# EAGLE design battery-monitor (EAGLE 9.6.2)
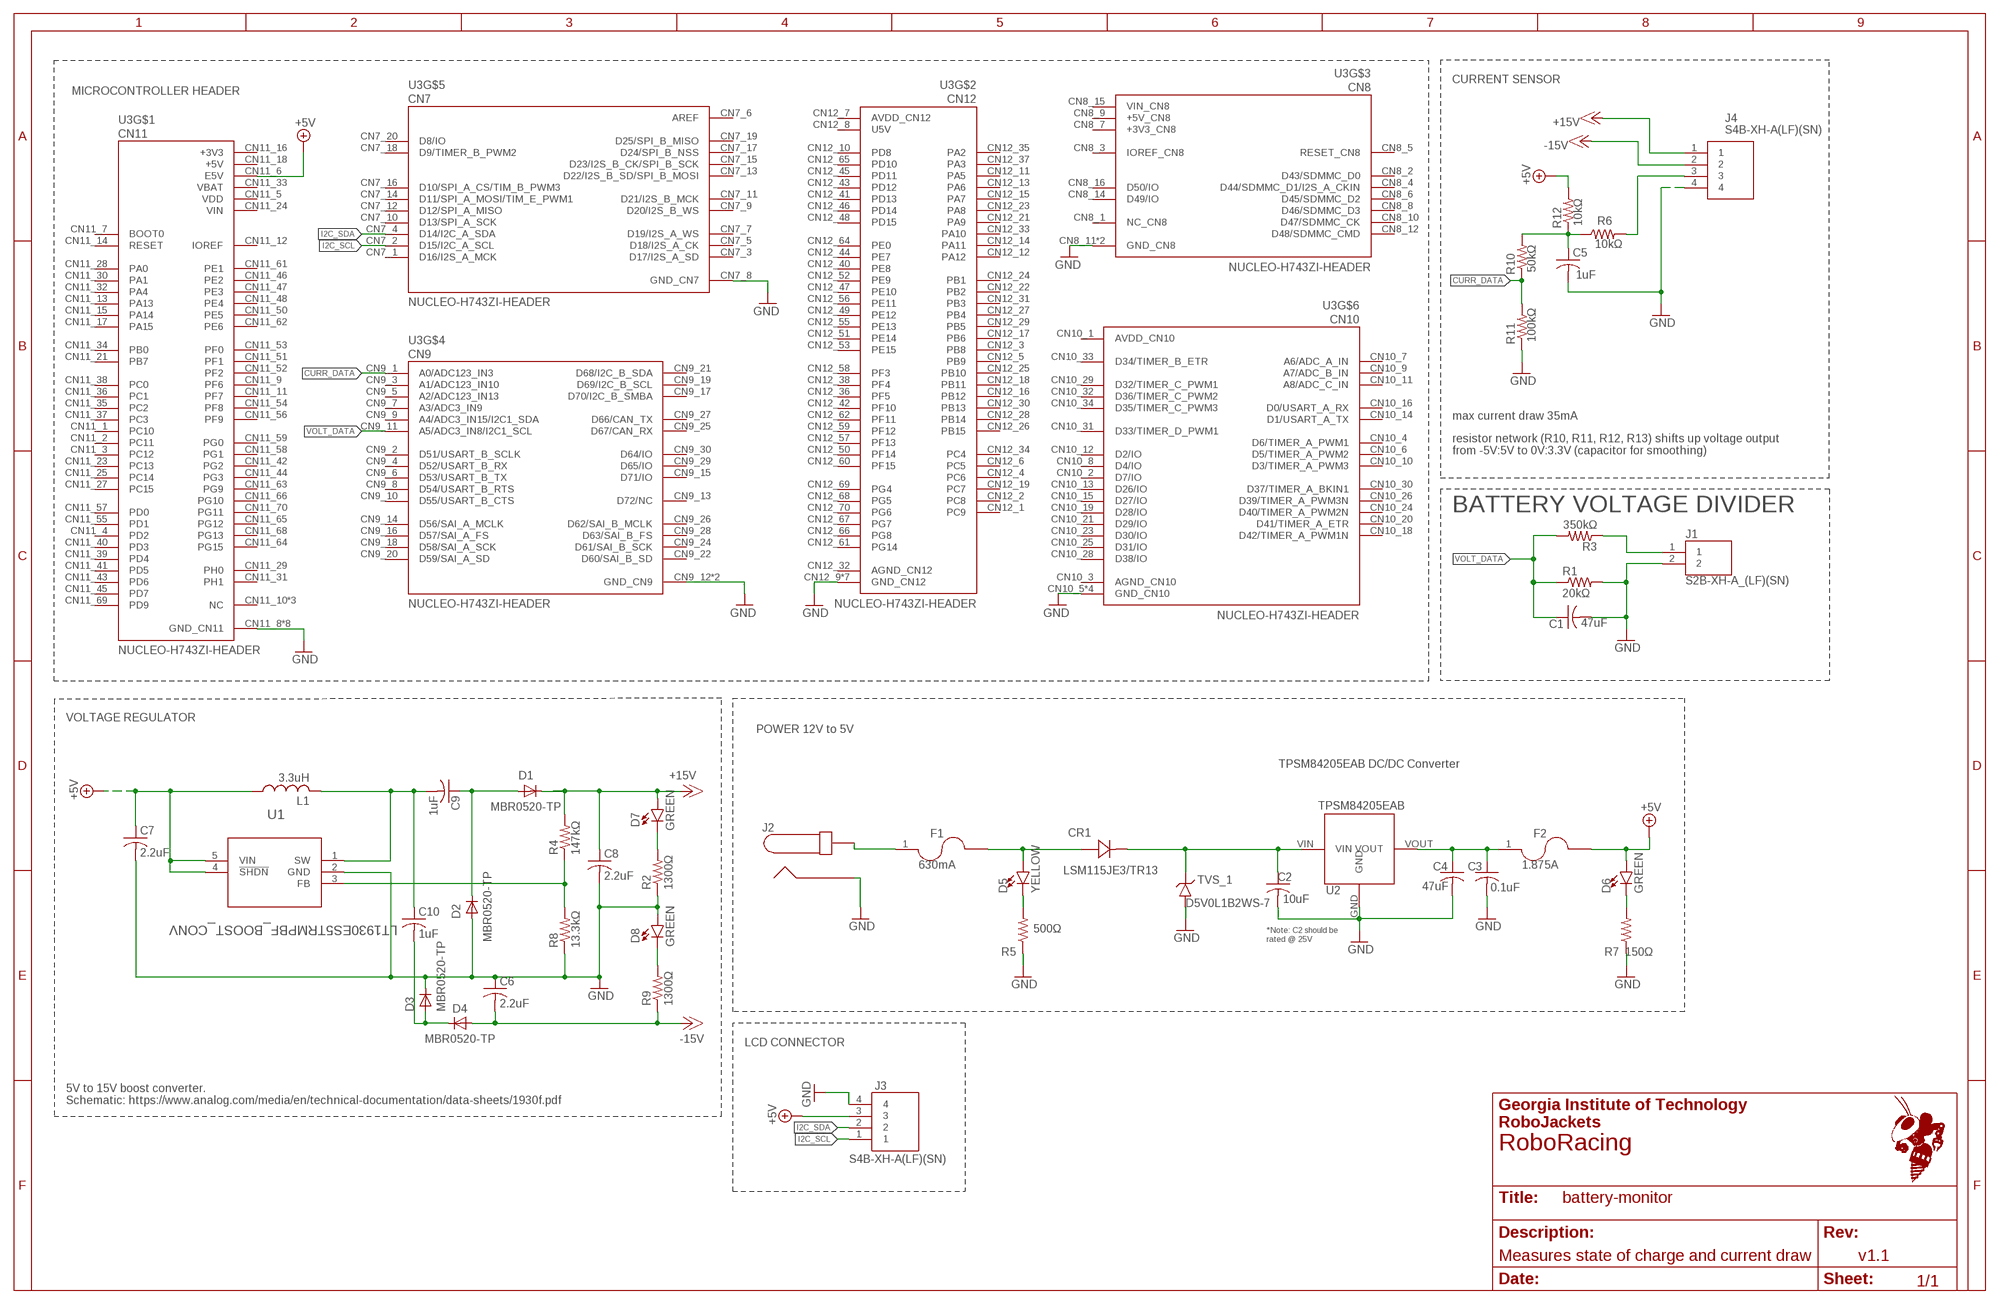
[diagram p0: schematic, sheet 1]
FRAME1 (FRAME_11_17): REVISION: v1.1; SCH_DESC: Measures state of charge and current draw; TEAM: RoboRacing

## Parts
C1  47uF  C-USC0603  [C0603]
C2  10uF  C-USC0603  [C0603]
C3  0.1uF  C-USC0603  [C0603]
C4  47uF  C-USC0603  [C0603]
C5  1uF  C-USC0603  [C0603]
C6  2.2uF  C-USC1206  [C1206]
C7  2.2uF  C-USC0805  [C0805]
C8  2.2uF  C-USC1206  [C1206]
C9  1uF  C-USC0603  [C0603]
C10  1uF  C-USC0603  [C0603]
CR1  LSM115JE3/TR13  [DO-214BA_MCH]
D1  MBR0520-TP  DIODE-SOD123  [SOD123]
D2  MBR0520-TP  DIODE-SOD123  [SOD123]
D3  MBR0520-TP  DIODE-SOD123  [SOD123]
D4  MBR0520-TP  DIODE-SOD123  [SOD123]
D5  YELLOW  LED-YELLOW0603  [LED-0603]
D6  GREEN  LED-GREEN1206  [LED-1206]
D7  GREEN  LED-GREEN0603  [LED-0603]
D8  GREEN  LED-GREEN0603  [LED-0603]
F1  630mA  SMD_FUSE0603  [F0603]
F2  1.875A  SMD_FUSE0603  [F0603]
J1  S2B-XH-A_(LF)(SN)  [SHDR2W80P0X250_1X2_740X1150X61]
J2  PJ-037A  [PJ-037A]
J3  S4B-XH-A(LF)(SN)  [SHDR4W64P0X250_1X4_1240X1155X7]
J4  S4B-XH-A(LF)(SN)  [SHDR4W64P0X250_1X4_1240X1155X7]
L1  3.3uH  L-USL3225M  [L3225M]
R1  20kΩ  R-US_R0603  [R0603]
R2  1300Ω  R-US_R0603  [R0603]
R3  350kΩ  R-US_R0603  [R0603]
R4  147kΩ  R-US_R0603  [R0603]
R5  500Ω  R-US_R0603  [R0603]
R6  10kΩ  R-US_R0603  [R0603]
R7  150Ω  R-US_R0603  [R0603]
R8  13.3kΩ  R-US_R0603  [R0603]
R9  1300Ω  R-US_R0603  [R0603]
R10  50kΩ  R-US_R0603  [R0603]
R11  100kΩ  R-US_R0603  [R0603]
R12  10kΩ  R-US_R0603  [R0603]
TVS_1  D5V0L1B2WS-7  [SOD-323]
U1  LT1930ES5TRMPBF_BOOST_CONV  [SOT-5_S]
U2  TPSM84205EAB  [TPSM84205EAB]
U3  NUCLEO-H743ZI-HEADER  [MODULE_NUCLEO-HEADER]

## Nets
5V_MAIN: C3.1 C4.1 F2.1 U2.VOUT
+5V [vcc]: C7.1 D6.A F2.2 J3.3 L1.1 R12.2 U1.4(!SHDN) U1.5(VIN) U3.CN11_6(E5V)
+15V [vcc]: C8.1 D1.C D7.A J4.1 R4.2
-15V [vcc]: C6.2 D4.A J4.2 R9.1
CURR_DATA [data]: R10.1 R11.2 U3.CN9_1(A0/ADC123_IN3)
CURR_RAW [data]: J4.3 R6.2
GND: C1.2 C2.2 C3.2 C4.2 C5.2 C6.1 C7.2 C8.2 D2.A D3.C D8.A J1.2 J2.P$1 J3.4 J4.4 R1.2 R2.1 R5.1 R7.1 R8.1 R11.1 TVS_1.A U1.2(GND) U2.GND U3.CN7_8(GND_CN7) U3.CN8_11(GND_CN8) U3.CN8_13(GND_CN8) U3.CN9_12(GND_CN9) U3.CN9_23(GND_CN9) U3.CN10_5(GND_CN10) U3.CN10_17(GND_CN10) U3.CN10_22(GND_CN10) U3.CN10_27(GND_CN10) U3.CN11_8(GND_CN11) U3.CN11_19(GND_CN11) U3.CN11_20(GND_CN11) U3.CN11_22(GND_CN11) U3.CN11_49(GND_CN11) U3.CN11_60(GND_CN11) U3.CN11_71(GND_CN11) U3.CN11_72(GND_CN11) U3.CN12_9(GND_CN12) U3.CN12_20(GND_CN12) U3.CN12_39(GND_CN12) U3.CN12_54(GND_CN12) U3.CN12_63(GND_CN12) U3.CN12_71(GND_CN12) U3.CN12_72(GND_CN12)
I2C_SCL: J3.1 U3.CN7_2(D15/I2C_A_SCL)
I2C_SDA: J3.2 U3.CN7_4(D14/I2C_A_SDA)
N$1: J1.1 R3.1
N$2: CR1.2 D5.A F1.2
N$3: C2.1 CR1.1 TVS_1.C U2.VIN
N$4: F1.1 J2.P$2
N$5: R4.1 R8.2 U1.3(FB)
N$6: C9.2 C10.1 L1.2 U1.1(SW)
N$7: D5.C R5.2
N$8: C10.2 D3.A D4.C
N$10: D6.C R7.2
N$11: C5.1 R6.1 R10.2 R12.1
N$14: D7.C R2.2
N$16: C9.1 D1.A D2.C
N$17: D8.C R9.2
VOLT_DATA: C1.1 R1.1 R3.2 U3.CN9_11(A5/ADC3_IN8/I2C1_SCL)
Unconnected: U3.CN7_1(D16/I2S_A_MCK) U3.CN7_3(D17/I2S_A_SD) U3.CN7_5(D18/I2S_A_CK) U3.CN7_7(D19/I2S_A_WS) U3.CN7_9(D20/I2S_B_WS) U3.CN7_10(D13/SPI_A_SCK) U3.CN7_11(D21/I2S_B_MCK) U3.CN7_12(D12/SPI_A_MISO) U3.CN7_13(D22/I2S_B_SD/SPI_B_MOSI) U3.CN7_14(D11/SPI_A_MOSI/TIM_E_PWM1) U3.CN7_15(D23/I2S_B_CK/SPI_B_SCK) U3.CN7_16(D10/SPI_A_CS/TIM_B_PWM3) U3.CN7_17(D24/SPI_B_NSS) U3.CN7_18(D9/TIMER_B_PWM2) U3.CN7_19(D25/SPI_B_MISO) U3.CN7_20(D8/IO) U3.CN8_1(NC_CN8) U3.CN8_2(D43/SDMMC_D0) U3.CN8_3(IOREF_CN8) U3.CN8_4(D44/SDMMC_D1/I2S_A_CKIN) U3.CN8_5(RESET_CN8) U3.CN8_6(D45/SDMMC_D2) U3.CN8_8(D46/SDMMC_D3) U3.CN8_10(D47/SDMMC_CK) U3.CN8_12(D48/SDMMC_CMD) U3.CN8_14(D49/IO) U3.CN8_16(D50/IO) U3.CN9_2(D51/USART_B_SCLK) U3.CN9_3(A1/ADC123_IN10) U3.CN9_4(D52/USART_B_RX) U3.CN9_5(A2/ADC123_IN13) U3.CN9_6(D53/USART_B_TX) U3.CN9_7(A3/ADC3_IN9) U3.CN9_8(D54/USART_B_RTS) U3.CN9_9(A4/ADC3_IN15/I2C1_SDA) U3.CN9_10(D55/USART_B_CTS) U3.CN9_13(D72/NC) U3.CN9_14(D56/SAI_A_MCLK) U3.CN9_15(D71/IO) U3.CN9_16(D57/SAI_A_FS) U3.CN9_17(D70/I2C_B_SMBA) U3.CN9_18(D58/SAI_A_SCK) U3.CN9_19(D69/I2C_B_SCL) U3.CN9_20(D59/SAI_A_SD) U3.CN9_21(D68/I2C_B_SDA) U3.CN9_22(D60/SAI_B_SD) U3.CN9_24(D61/SAI_B_SCK) U3.CN9_25(D67/CAN_RX) U3.CN9_26(D62/SAI_B_MCLK) U3.CN9_27(D66/CAN_TX) U3.CN9_28(D63/SAI_B_FS) U3.CN9_29(D65/IO) U3.CN9_30(D64/IO) U3.CN10_2(D7/IO) U3.CN10_4(D6/TIMER_A_PWM1) U3.CN10_6(D5/TIMER_A_PWM2) U3.CN10_7(A6/ADC_A_IN) U3.CN10_8(D4/IO) U3.CN10_9(A7/ADC_B_IN) U3.CN10_10(D3/TIMER_A_PWM3) U3.CN10_11(A8/ADC_C_IN) U3.CN10_12(D2/IO) U3.CN10_13(D26/IO) U3.CN10_14(D1/USART_A_TX) U3.CN10_15(D27/IO) U3.CN10_16(D0/USART_A_RX) U3.CN10_18(D42/TIMER_A_PWM1N) U3.CN10_19(D28/IO) U3.CN10_20(D41/TIMER_A_ETR) U3.CN10_21(D29/IO) U3.CN10_23(D30/IO) U3.CN10_24(D40/TIMER_A_PWM2N) U3.CN10_25(D31/IO) U3.CN10_26(D39/TIMER_A_PWM3N) U3.CN10_28(D38/IO) U3.CN10_29(D32/TIMER_C_PWM1) U3.CN10_30(D37/TIMER_A_BKIN1) U3.CN10_31(D33/TIMER_D_PWM1) U3.CN10_32(D36/TIMER_C_PWM2) U3.CN10_33(D34/TIMER_B_ETR) U3.CN10_34(D35/TIMER_C_PWM3) U3.CN11_1(PC10) U3.CN11_2(PC11) U3.CN11_3(PC12) U3.CN11_4(PD2) U3.CN11_7(BOOT0) U3.CN11_9(PF6) U3.CN11_10(NC) U3.CN11_11(PF7) U3.CN11_12(IOREF) U3.CN11_13(PA13) U3.CN11_14(RESET) U3.CN11_15(PA14) U3.CN11_17(PA15) U3.CN11_21(PB7) U3.CN11_23(PC13) U3.CN11_25(PC14) U3.CN11_26(NC) U3.CN11_27(PC15) U3.CN11_28(PA0) U3.CN11_29(PH0) U3.CN11_30(PA1) U3.CN11_31(PH1) U3.CN11_32(PA4) U3.CN11_34(PB0) U3.CN11_35(PC2) U3.CN11_36(PC1) U3.CN11_37(PC3) U3.CN11_38(PC0) U3.CN11_39(PD4) U3.CN11_40(PD3) U3.CN11_41(PD5) U3.CN11_42(PG2) U3.CN11_43(PD6) U3.CN11_44(PG3) U3.CN11_45(PD7) U3.CN11_46(PE2) U3.CN11_47(PE3) U3.CN11_48(PE4) U3.CN11_50(PE5) U3.CN11_51(PF1) U3.CN11_52(PF2) U3.CN11_53(PF0) U3.CN11_54(PF8) U3.CN11_55(PD1) U3.CN11_56(PF9) U3.CN11_57(PD0) U3.CN11_58(PG1) U3.CN11_59(PG0) U3.CN11_61(PE1) U3.CN11_62(PE6) U3.CN11_63(PG9) U3.CN11_64(PG15) U3.CN11_65(PG12) U3.CN11_66(PG10) U3.CN11_67(NC) U3.CN11_68(PG13) U3.CN11_69(PD9) U3.CN11_70(PG11) U3.CN12_1(PC9) U3.CN12_2(PC8) U3.CN12_3(PB8) U3.CN12_4(PC6) U3.CN12_5(PB9) U3.CN12_6(PC5) U3.CN12_10(PD8) U3.CN12_11(PA5) U3.CN12_12(PA12) U3.CN12_13(PA6) U3.CN12_14(PA11) U3.CN12_15(PA7) U3.CN12_16(PB12) U3.CN12_17(PB6) U3.CN12_18(PB11) U3.CN12_19(PC7) U3.CN12_21(PA9) U3.CN12_22(PB2) U3.CN12_23(PA8) U3.CN12_24(PB1) U3.CN12_25(PB10) U3.CN12_26(PB15) U3.CN12_27(PB4) U3.CN12_28(PB14) U3.CN12_29(PB5) U3.CN12_30(PB13) U3.CN12_31(PB3) U3.CN12_33(PA10) U3.CN12_34(PC4) U3.CN12_35(PA2) U3.CN12_36(PF5) U3.CN12_37(PA3) U3.CN12_38(PF4) U3.CN12_40(PE8) U3.CN12_41(PD13) U3.CN12_42(PF10) U3.CN12_43(PD12) U3.CN12_44(PE7) U3.CN12_45(PD11) U3.CN12_46(PD14) U3.CN12_47(PE10) U3.CN12_48(PD15) U3.CN12_49(PE12) U3.CN12_50(PF14) U3.CN12_51(PE14) U3.CN12_52(PE9) U3.CN12_53(PE15) U3.CN12_55(PE13) U3.CN12_56(PE11) U3.CN12_57(PF13) U3.CN12_58(PF3) U3.CN12_59(PF12) U3.CN12_60(PF15) U3.CN12_61(PG14) U3.CN12_62(PF11) U3.CN12_64(PE0) U3.CN12_65(PD10) U3.CN12_66(PG8) U3.CN12_67(PG7) U3.CN12_68(PG5) U3.CN12_69(PG4) U3.CN12_70(PG6)

## Notes on the sheet
- CURRENT SENSOR
- MICROCONTROLLER HEADER
- max current draw 35mA
- resistor network (R10, R11, R12, R13) shifts up voltage output
  from -5V:5V to 0V:3.3V (capacitor for smoothing)
- BATTERY VOLTAGE DIVIDER
- VOLTAGE REGULATOR
- POWER 12V to 5V
- TPSM84205EAB DC/DC Converter
- *Note: C2 should be
  rated @ 25V
- LCD CONNECTOR
- 5V to 15V boost converter. 
  Schematic: https://www.analog.com/media/en/technical-documentation/data-sheets/1930f.pdf

## Power pins joined to a net without a drawn wire
+3V3: U3.CN11_16(+3V3)
+3V3_CN8: U3.CN8_7(+3V3_CN8)
+5V: U3.CN11_18(+5V)
+5V_CN8: U3.CN8_9(+5V_CN8)
AGND_CN10: U3.CN10_3(AGND_CN10)
AGND_CN12: U3.CN12_32(AGND_CN12)
AREF: U3.CN7_6(AREF)
AVDD_CN10: U3.CN10_1(AVDD_CN10)
AVDD_CN12: U3.CN12_7(AVDD_CN12)
U5V: U3.CN12_8(U5V)
VBAT: U3.CN11_33(VBAT)
VDD: U3.CN11_5(VDD)
VIN: U3.CN11_24(VIN)
VIN_CN8: U3.CN8_15(VIN_CN8)

## Library data of the parts
C1-C5 = rcl:C-US: CAPACITOR, American symbol; SPICEPREFIX: C
C6 C8 = rcl:C-US: CAPACITOR, American symbol; DKPT: 587-5840-1-ND; SPICEPREFIX: C
C7 = rcl:C-US: CAPACITOR, American symbol; DKPT: 587-5919-1-ND; SPICEPREFIX: C
C9 C10 = rcl:C-US: CAPACITOR, American symbol; DKPT: 311-1445-1-ND; SPICEPREFIX: C
CR1 = RoboRacing_STM:LSM115JE3/TR13; COPYRIGHT: Copyright (C) 2022 Ultra Librarian. All rights reserved.; MANUFACTURER_PART_NUMBER: LSM115JE3/TR13; MFR_NAME: Microchip
D1-D4 = RoboJackets-Diodes:DIODE-: DIODE; DKPT: MBR0520TPMSCT-ND
D5 = RoboJackets-LEDs:LED-YELLOW: Yellow SMD LED Used in manufacturing several products at SparkFun. Packages: 0603 - SMD 0603 package[Product Link] <http://www.kingbrightusa.com/product.asp?catalog_name=LED&product_id=APT1608SYCK> 0603 -SMART - SMART SMD 0603 package (more efficient/more expensive) [Product Link] <http://www.osram-os.com/osram_os/en/products/product-catalog/led-light-emitting-diodes/smartled-0603/ly-l29k/index.jsp> LilyPad - SMD1206 package[Product Datasheet] <https://www.sparkfun.com/datasheets/DevTools/LilyPad/Q150YUS4.pdf> SparkFun Products: Blynk Board <https://www.sparkfun.com/products/13794> IOIO-OTG <https://www.sparkfun.com/products/13613> XBee Explorer Serial <https://www.sparkfun.com/products/13225>; PROD_ID: DIO-09003; VALUE: Yellow
D6 = RoboJackets-LEDs:LED-GREEN: Green SMD LED Used in manufacturing of various products at SparkFun Packages: 0603 - SMD 0603 package [Product Link] <http://www.futureelectronics.com/en/technologies/semiconductors/optoelectronics/leds/Pages/9894312-LTST-C190GKT.aspx?CrossPart=HSMG-C190&IM=0> LilyPad 1206 - SMD1206 LilyPad package [Product Link] <http://www.futureelectronics.com/en/Technologies/Product.aspx?ProductID=IN150NGHARVATEKCORPORATION2049943&IM=0> 1206 - SMD1206 package [Product Link] <http://www.futureelectronics.com/en/technologies/semiconductors/optoelectronics/leds/Pages/8315665-LTST-C150KGKT.aspx?IM=0> 1206 Bottom Mount -SMD 1206 Bottom Mount [Product Link] <http://www.digikey.com/product-detail/en/lite-on-inc/LTST-C230KGKT/160-1456-1-ND/386854> SparkFun Products: Pro Mini 328 -5V <https://www.sparkfun.com/products/821> RedBoard <https://www.sparkfun.com/products/12757> MP3 Trigger <https://www.sparkfun.com/products/13720> Makey Makey <https://www.sparkfun.com/products/11076>; PROD_ID: DIO-00862
D7 D8 = RoboJackets-LEDs:LED-GREEN: Green SMD LED Used in manufacturing of various products at SparkFun Packages: 0603 - SMD 0603 package [Product Link] <http://www.futureelectronics.com/en/technologies/semiconductors/optoelectronics/leds/Pages/9894312-LTST-C190GKT.aspx?CrossPart=HSMG-C190&IM=0> LilyPad 1206 - SMD1206 LilyPad package [Product Link] <http://www.futureelectronics.com/en/Technologies/Product.aspx?ProductID=IN150NGHARVATEKCORPORATION2049943&IM=0> 1206 - SMD1206 package [Product Link] <http://www.futureelectronics.com/en/technologies/semiconductors/optoelectronics/leds/Pages/8315665-LTST-C150KGKT.aspx?IM=0> 1206 Bottom Mount -SMD 1206 Bottom Mount [Product Link] <http://www.digikey.com/product-detail/en/lite-on-inc/LTST-C230KGKT/160-1456-1-ND/386854> SparkFun Products: Pro Mini 328 -5V <https://www.sparkfun.com/products/821> RedBoard <https://www.sparkfun.com/products/12757> MP3 Trigger <https://www.sparkfun.com/products/13720> Makey Makey <https://www.sparkfun.com/products/11076>; PROD_ID: DIO-00821
F1 F2 = RoboJackets-Fuses:SMD_FUSE: Generic part for SMD fuses
J1 = drive_brake:S2B-XH-A_(LF)(SN): JST (JAPAN SOLDERLESS TERMINALS) - S2B-XH-A (LF)(SN) - CONNECTOR, HEADER, THT, R/A, 2.5MM, 2WAY Source: Datasheet <http://www.jst-mfg.com/product/pdf/eng/eXH.pdf>; DESCRIPTION: JST (JAPAN SOLDERLESS TERMINALS) - S2B-XH-A (LF)(SN) - CONNECTOR, HEADER, THT, R/A, 2.5MM, 2WAY; HEIGHT: 6.1mm; MANUFACTURER_NAME: JST (JAPAN SOLDERLESS TERMINALS); MANUFACTURER_PART_NUMBER: S2B-XH-A (LF)(SN)
J2 = RoboJackets-Connectors:PJ-037A*: Description: Power Barrel Connector Jack 2.10mm ID (0.083"), 5.50mm OD (0.217") Through Hole, Right Angle Link 2.5A: Digi-Key <https://www.digikey.com/products/en?keywords=CP-037A-ND> Link 5A: Digi-Key <https://www.digikey.com/product-detail/en/cui-devices/PJ-037AH/CP-037AH-ND/1644547>; DKPN: CP-037A-ND
J3 J4 = drive_brake:S4B-XH-A(LF)(SN): XH-2.5mm Header side entry 4 way JST XH Series, Series Number S4B, 2.5mm Pitch 4 Way 1 Row Right Angle PCB Header, Solder Termination, 3A Source: Datasheet <http://www.jst-mfg.com/product/pdf/eng/eXH.pdf>; DESCRIPTION: XH-2.5mm Header side entry 4 way JST XH Series, Series Number S4B, 2.5mm Pitch 4 Way 1 Row Right Angle PCB Header, Solder Termination, 3A; HEIGHT: 7mm; MANUFACTURER_NAME: JST (JAPAN SOLDERLESS TERMINALS); MANUFACTURER_PART_NUMBER: S4B-XH-A(LF)(SN); RS_PART_NUMBER: 8201589P; RS_PRICE-STOCK: http://uk.rs-online.com/web/p/products/8201589P
L1 = rcl:L-US: INDUCTOR, American symbol; DKPT: 535-12564-1-ND; SPICEPREFIX: L
R1 R3 R5-R7 R10-R12 = rcl:R-US_: RESISTOR, American symbol; SPICEPREFIX: R
R2 R9 = rcl:R-US_: RESISTOR, American symbol; DKPT: RR08P1.3KDCT-ND; SPICEPREFIX: R
R4 = rcl:R-US_: RESISTOR, American symbol; DKPT: 311-147KHRCT-ND; SPICEPREFIX: R
R8 = rcl:R-US_: RESISTOR, American symbol; DKPT: RR08P13.3KDCT-ND; SPICEPREFIX: R
TVS_1 = RoboJackets-Diodes:D5V0L1B2WS-7: TVS 5V Diode Datasheet <https://www.diodes.com/assets/Datasheets/D5V0L1B2WS.pdf>; DKPN: D5V0L1B2WS-7DICT-ND
U1 = drive_brake:LT1930ES5TRMPBF_BOOST_CONV; MANUFACTURER_PART_NUMBER: LT1930ES5#TRMPBF; VENDOR: Linear Technology
U2 = RoboRacing_STM:TPSM84205EAB: 1.5A, 28V Input, 5V Output Power Module https://www.ti.com/lit/ds/symlink/tpsm84205.pdf?ts=1642464100890&ref_url=https%253A%252F%252Fwww.ti.com%252Fstore%252Fti%252Fen%252Fp%252Fproduct%252F%253Fp%253DTPSM84205EAB; DKPN: 296-47074-ND
U3 = RoboRacing_STM:NUCLEO-H743ZI-HEADER: STM32F429ZI, mbed-Enabled Development Nucleo-144 STM32F4 ARM® Cortex®-M4 MCU 32-Bit Embedded Evaluation Board; MANUFACTURER: STMicroelectronics; MAXIMUM_PACKAGE_HEIGHT: N/A; PARTREV: 8; STANDARD: Manufacturer Recommendations

## Net classes
0 default: width 0.25 mm, drill 0.35 mm, clearance 0.205 mm
1 vcc: width 0.3 mm, clearance 0.205 mm to class 0, clearance 0.205 mm
3 data: width 0.25 mm, clearance 0.205 mm to class 0, clearance 0.205 mm to class 1, clearance 0.205 mm to class 2, clearance 0.205 mm

## Board
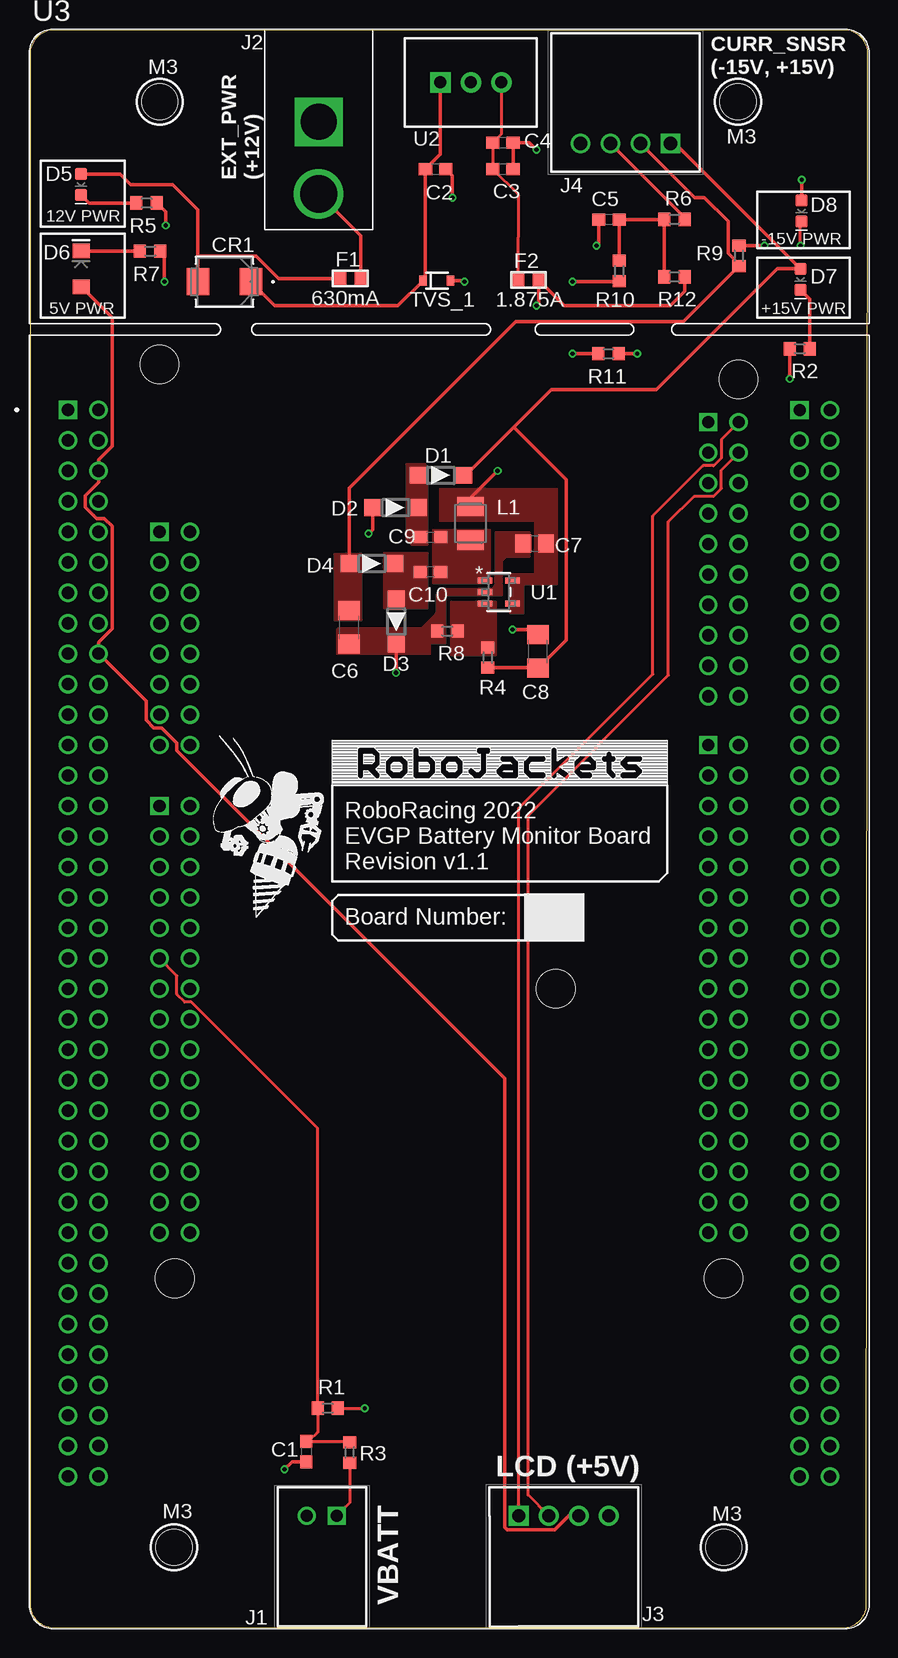
[diagram p1: board, top side]
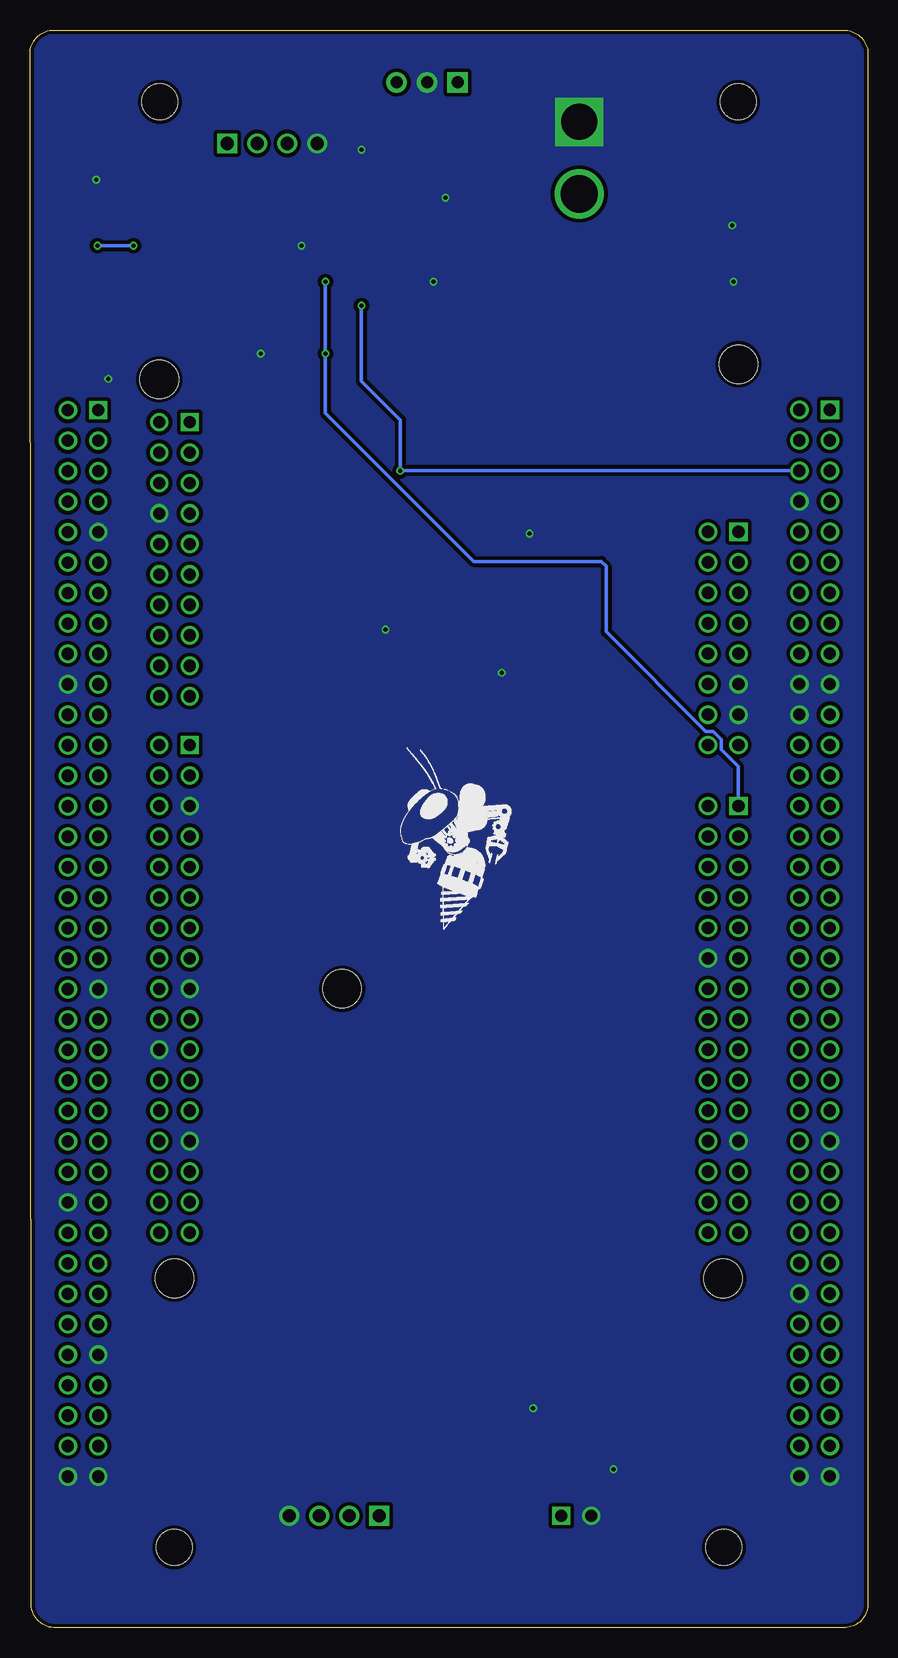
[diagram p2: board, bottom side, seen from below]

Size 69.83 x 133.19 mm. Coordinates in mm from the lower left corner, seen from the top.
Outline: 67.83,133.19 2.04,133.19 arc90 0,131.15 0,2.08 arc90 1.87,0.02 67.48,0.02 arc90 69.71,1.72 69.83,131.19 arc90 67.83,133.19
Copper layers (1+16): Top 0.035mm / dielectric 1.53mm / Bottom 0.035mm
Design rules "JLCPCB (2 Layer)": minimum track width 5mil, minimum drill 0.3mm, track to track 5mil, track to pad 5mil, pad to pad 5mil, via to via 20mil, smd to smd 5mil, copper to edge 0.2mm, drill to drill 21mil, minimum pad ring 6mil, minimum via ring 6mil, stop-mask expansion 2mil, vias tented up to drill 30mil, thermal gap 10mil
Holes 3 mm at 57.81,6.7 12.01,6.7 59.01,127.2 10.81,127.2

### Footprints (pad centres in the part's own frame; a part is rotated, then mirrored left to right if it is on the bottom)
C0603 = smd 1.1 x 1: 1 -0.85,0; 2 0.85,0
C1206 = smd 1.6 x 1.8: 1 -1.4,0; 2 1.4,0
C0805 = smd 1.3 x 1.5: 1 -0.95,0; 2 0.95,0
DO-214BA_MCH = smd 1.874 x 2.26: 1 -2.207,0; 2 2.207,0
SOD123 = smd 1.4 x 1.4: A 1.9,0; C -1.9,0
LED-0603 = smd 1 x 1: A -0.877,0; C 0.877,0
LED-1206 = smd 1.2 x 1.4: A -1.5,0; C 1.5,0
F0603 = smd 1 x 1.1: 1 -0.85,0; 2 0.85,0
SHDR2W80P0X250_1X2_740X1150X61 = drill 1 pad 1.5 square: 1 -1.27,-3.81 | drill 1 pad 1.5: 2 1.23,-3.81
PJ-037A = drill 3 square: P$1 0,0 | drill 3.1: P$2 6,0
SHDR4W64P0X250_1X4_1240X1155X7 = drill 1.1 pad 1.65 square: 1 0,0 | drill 1.1 pad 1.65: 2 2.5,0; 3 5,0; 4 7.5,0
L3225M = smd 1.6 x 2.2: 1 -1.4,0; 2 1.4,0
R0603 = smd 1 x 1.1: 1 -0.85,0; 2 0.85,0
SOD-323 = smd 0.63 x 0.83: A 1.15,0; C -1.15,0
SOT-5_S = smd 1.211 x 0.501: 1 -1.15,0.95; 2 -1.15,0; 3 -1.15,-0.95; 4 1.15,-0.95; 5 1.15,0.95
TPSM84205EAB = drill 1.01 pad 1.71: GND 0,0; VOUT 2.54,0 | drill 1.01 pad 1.71 square: VIN -2.54,0
MODULE_NUCLEO-HEADER = drill 1.02 square: CN7_1 21.59,33.914; CN8_1 -24.13,24.77; CN9_1 -24.13,1.91; CN10_1 21.59,6.99; CN11_1 -31.75,34.93; CN12_1 29.21,34.91 | drill 1.02: CN7_2 24.13,33.914; CN7_3 21.59,31.374; CN7_4 24.13,31.374; CN7_5 21.59,28.834; CN7_6 24.13,28.834; CN7_7 21.59,26.294; CN7_8 24.13,26.294; CN7_9 21.59,23.754; CN7_10 24.13,23.754; CN7_11 21.59,21.214; CN7_12 24.13,21.214; CN7_13 21.59,18.674; CN7_14 24.13,18.674; CN7_15 21.59,16.134; CN7_16 24.13,16.134; CN7_17 21.59,13.594; CN7_18 24.13,13.594; CN7_19 21.59,11.054; CN7_20 24.13,11.054; CN8_2 -21.59,24.77; CN8_3 -24.13,22.23; CN8_4 -21.59,22.23; CN8_5 -24.13,19.69; CN8_6 -21.59,19.69; CN8_7 -24.13,17.15; CN8_8 -21.59,17.15; CN8_9 -24.13,14.61; CN8_10 -21.59,14.61; CN8_11 -24.13,12.07; CN8_12 -21.59,12.07; CN8_13 -24.13,9.53; CN8_14 -21.59,9.53; CN8_15 -24.13,6.99; CN8_16 -21.59,6.99; CN9_2 -21.59,1.91; CN9_3 -24.13,-0.63; CN9_4 -21.59,-0.63; CN9_5 -24.13,-3.17; CN9_6 -21.59,-3.17; CN9_7 -24.13,-5.71; CN9_8 -21.59,-5.71; CN9_9 -24.13,-8.25; CN9_10 -21.59,-8.25; CN9_11 -24.13,-10.79; CN9_12 -21.59,-10.79; CN9_13 -24.13,-13.33; CN9_14 -21.59,-13.33; CN9_15 -24.13,-15.87; CN9_16 -21.59,-15.87; CN9_17 -24.13,-18.41; CN9_18 -21.59,-18.41; CN9_19 -24.13,-20.95; CN9_20 -21.59,-20.95; CN9_21 -24.13,-23.49; CN9_22 -21.59,-23.49; CN9_23 -24.13,-26.03; CN9_24 -21.59,-26.03; CN9_25 -24.13,-28.57; CN9_26 -21.59,-28.57; CN9_27 -24.13,-31.11; CN9_28 -21.59,-31.11; CN9_29 -24.13,-33.65; CN9_30 -21.59,-33.65; CN10_2 24.13,6.99; CN10_3 21.59,4.45; CN10_4 24.13,4.45; CN10_5 21.59,1.91; CN10_6 24.13,1.91; CN10_7 21.59,-0.63; CN10_8 24.13,-0.63; CN10_9 21.59,-3.17; CN10_10 24.13,-3.17; CN10_11 21.59,-5.71; CN10_12 24.13,-5.71; CN10_13 21.59,-8.25; CN10_14 24.13,-8.25; CN10_15 21.59,-10.79; CN10_16 24.13,-10.79; CN10_17 21.59,-13.33; CN10_18 24.13,-13.33; CN10_19 21.59,-15.87; CN10_20 24.13,-15.87; CN10_21 21.59,-18.41; CN10_22 24.13,-18.41; CN10_23 21.59,-20.95; CN10_24 24.13,-20.95; CN10_25 21.59,-23.49; CN10_26 24.13,-23.49; CN10_27 21.59,-26.03; CN10_28 24.13,-26.03; CN10_29 21.59,-28.57; CN10_30 24.13,-28.57; CN10_31 21.59,-31.11; CN10_32 24.13,-31.11; CN10_33 21.59,-33.65; CN10_34 24.13,-33.65; CN11_2 -29.21,34.93; CN11_3 -31.75,32.39; CN11_4 -29.21,32.39; CN11_5 -31.75,29.85; CN11_6 -29.21,29.85; CN11_7 -31.75,27.31; CN11_8 -29.21,27.31; CN11_9 -31.75,24.77; CN11_10 -29.21,24.77; CN11_11 -31.75,22.23; CN11_12 -29.21,22.23; CN11_13 -31.75,19.69; CN11_14 -29.21,19.69; CN11_15 -31.75,17.15; CN11_16 -29.21,17.15; CN11_17 -31.75,14.61; CN11_18 -29.21,14.61; CN11_19 -31.75,12.07; CN11_20 -29.21,12.07; CN11_21 -31.75,9.53; CN11_22 -29.21,9.53; CN11_23 -31.75,6.99; CN11_24 -29.21,6.99; CN11_25 -31.75,4.45; CN11_26 -29.21,4.45; CN11_27 -31.75,1.91; CN11_28 -29.21,1.91; CN11_29 -31.75,-0.63; CN11_30 -29.21,-0.63; CN11_31 -31.75,-3.17; CN11_32 -29.21,-3.17; CN11_33 -31.75,-5.71; CN11_34 -29.21,-5.71; CN11_35 -31.75,-8.25; CN11_36 -29.21,-8.25; CN11_37 -31.75,-10.79; CN11_38 -29.21,-10.79; CN11_39 -31.75,-13.33; CN11_40 -29.21,-13.33; CN11_41 -31.75,-15.87; CN11_42 -29.21,-15.87; CN11_43 -31.75,-18.41; CN11_44 -29.21,-18.41; CN11_45 -31.75,-20.95; CN11_46 -29.21,-20.95; CN11_47 -31.75,-23.49; CN11_48 -29.21,-23.49; CN11_49 -31.75,-26.03; CN11_50 -29.21,-26.03; CN11_51 -31.75,-28.57; CN11_52 -29.21,-28.57; CN11_53 -31.75,-31.11; CN11_54 -29.21,-31.11; CN11_55 -31.75,-33.65; CN11_56 -29.21,-33.65; CN11_57 -31.75,-36.19; CN11_58 -29.21,-36.19; CN11_59 -31.75,-38.73; CN11_60 -29.21,-38.73; CN11_61 -31.75,-41.27; CN11_62 -29.21,-41.27; CN11_63 -31.75,-43.81; CN11_64 -29.21,-43.81; CN11_65 -31.75,-46.35; CN11_66 -29.21,-46.35; CN11_67 -31.75,-48.89; CN11_68 -29.21,-48.89; CN11_69 -31.75,-51.43; CN11_70 -29.21,-51.43; CN11_71 -31.75,-53.97; CN11_72 -29.21,-53.97; CN12_2 31.75,34.91; CN12_3 29.21,32.37; CN12_4 31.75,32.37; CN12_5 29.21,29.83; CN12_6 31.75,29.83; CN12_7 29.21,27.29; CN12_8 31.75,27.29; CN12_9 29.21,24.75; CN12_10 31.75,24.75; CN12_11 29.21,22.21; CN12_12 31.75,22.21; CN12_13 29.21,19.67; CN12_14 31.75,19.67; CN12_15 29.21,17.13; CN12_16 31.75,17.13; CN12_17 29.21,14.59; CN12_18 31.75,14.59; CN12_19 29.21,12.05; CN12_20 31.75,12.05; CN12_21 29.21,9.51; CN12_22 31.75,9.51; CN12_23 29.21,6.97; CN12_24 31.75,6.97; CN12_25 29.21,4.43; CN12_26 31.75,4.43; CN12_27 29.21,1.89; CN12_28 31.75,1.89; CN12_29 29.21,-0.65; CN12_30 31.75,-0.65; CN12_31 29.21,-3.19; CN12_32 31.75,-3.19; CN12_33 29.21,-5.73; CN12_34 31.75,-5.73; CN12_35 29.21,-8.27; CN12_36 31.75,-8.27; CN12_37 29.21,-10.81; CN12_38 31.75,-10.81; CN12_39 29.21,-13.35; CN12_40 31.75,-13.35; CN12_41 29.21,-15.89; CN12_42 31.75,-15.89; CN12_43 29.21,-18.43; CN12_44 31.75,-18.43; CN12_45 29.21,-20.97; CN12_46 31.75,-20.97; CN12_47 29.21,-23.51; CN12_48 31.75,-23.51; CN12_49 29.21,-26.05; CN12_50 31.75,-26.05; CN12_51 29.21,-28.59; CN12_52 31.75,-28.59; CN12_53 29.21,-31.13; CN12_54 31.75,-31.13; CN12_55 29.21,-33.67; CN12_56 31.75,-33.67; CN12_57 29.21,-36.21; CN12_58 31.75,-36.21; CN12_59 29.21,-38.75; CN12_60 31.75,-38.75; CN12_61 29.21,-41.29; CN12_62 31.75,-41.29; CN12_63 29.21,-43.83; CN12_64 31.75,-43.83; CN12_65 29.21,-46.37; CN12_66 31.75,-46.37; CN12_67 29.21,-48.91; CN12_68 31.75,-48.91; CN12_69 29.21,-51.45; CN12_70 31.75,-51.45; CN12_71 29.21,-53.99; CN12_72 31.75,-53.99 | hole 3.2: -22.86,-37.46; 22.86,-37.46; 24.13,37.47; 8.89,-13.33; -24.13,38.74

### Placement (x,y rotation side)
C1  23.02,14.69 270 top
C2  33.81,121.6 0 top
C3  39.41,121.6 0 top
C4  39.41,123.8 0 top
C5  48.25,117.39 180 top
C6  26.6,83.39 90 top
C7  42.06,90.36 180 top
C8  42.34,81.39 90 top
C9  33.39,90.92 0 top
C10  33.37,88.02 180 top
CR1  16.21,112.2 180 top
D1  34.25,96.07 180 top
D2  30.46,93.37 180 top
D3  30.52,83.88 90 top
D4  28.5,88.71 180 top
D5  4.26,120.31 270 top
D6  4.27,113.28 90 top
D7  64.21,112.4 270 top
D8  64.31,118.1 270 top
F1  26.7,112.47 180 top
F2  41.54,112.34 0 top
J1  24.31,5.53 180 top
J2  24.06,125.53 270 top
J3  40.74,9.34 0 top
J4  53.38,123.73 180 top
L1  36.7,92.05 270 top
R1  24.82,18.31 0 top
R2  64.15,106.61 0 top
R3  26.64,14.62 90 top
R4  38.15,80.88 270 top
R5  9.72,118.77 180 top
R6  53.71,117.4 0 top
R7  10.01,114.74 180 top
R8  34.79,83.08 0 top
R9  59.08,114.37 90 top
R10  49.11,113.1 90 top
R11  48.21,106.2 180 top
R12  53.71,112.6 0 top
TVS_1  33.91,112.29 0 top
U1  39.06,86.33 0 top
U2  36.74,128.82 0 top
U3  34.93,66.59 0 top
U$1  [ROBOBUZZ_0.8X]  18.81,59.2 0 top
U$2  [ROBOJACKETS]  25.21,70.2 0 top
U$3  [ROBOBUZZ_0.8X]  35.41,58.2 0 bottom

### Tracks (layer width: path | path; a pad name or v marks a point on that pad's centre or on a via)
5V_MAIN
  Top 0.25: U2.VOUT 39.28,124.52 C4.1 C3.1 40.72,119.44 F2.1
+5V  (via drill 0.35)
  Top 0.3: D6.A 6.84,109.21 6.84,98.52 5.72,97.4 U3.CN11_6 5.72,95.49 4.6,94.37 4.6,93.44 5.55,92.48 6.18,92.48 6.84,91.83 6.84,83.28 5.72,82.16 U3.CN11_18 9.68,77.24 9.68,75.66 10.33,75 10.96,75 12.22,73.75 12.22,73.12 39.56,45.78 39.56,8.37 39.76,8.16 43.72,8.16 44.9,9.34 J3.3 | v42.21,110.2 42.39,110.39 F2.2 44.53,110.2 53.34,110.2 54.56,111.42 R12.2 | v38.97,96.44 36.7,94.17 L1.1
  Bottom 0.3: U3.CN11_6 v38.97,96.44 38.97,100.68 42.21,103.92 v42.21,110.2
  pour Top (no thermals): 40.01,84.6 40.01,87.8 42.11,87.8 42.11,92.3 34.21,92.3 34.21,94.9 43.91,94.9 43.91,87 41.11,87 41.11,84.6
+15V
  Top 0.3: R4.2 42.3,80.03 C8.1 44.7,82.36 44.7,95.71 40.33,100.08 | D1.C 36.32,96.07 40.33,100.08 | 40.33,100.08 43.45,103.2 52.21,103.2 62.28,113.28 D7.A 53.75,123.73 J4.1
-15V
  Top 0.3: D4.A 26.6,95.01 40.47,108.88 54.44,108.88 58.98,113.43 | 26.53,84.72 C6.2 | R9.1 58.98,113.43 | J4.2 55.41,119.2 56.21,119.2 58.17,117.24 58.17,114.57 58.98,113.76 58.98,113.43
  pour Top (no thermals): 25.41,89.5 27.61,89.5 27.61,84 25.41,84
CURR_DATA  (via drill 0.35)
  Top 0.3: R10.1 49.06,112.2 v45.21,112.2 | R11.2 v45.21,106.2
  Bottom 0.3: U3.CN9_1 10.8,71.79 12.22,73.21 12.22,74.05 12.87,74.7 13.5,74.7 21.82,83.03 21.82,88.48 22.22,88.88 32.85,88.88 45.21,101.24 v45.21,106.2 v45.21,112.2
CURR_RAW
  Top 0.3: R6.2 54.56,117.55 J4.3
GND  (via drill 0.35)
  Top 0.25: R1.2 v27.9,18.31 v27.91,18.3
  Top 0.3: C3.2 C4.2 41.61,123.8 v42.21,123.2 | TVS_1.A 36.12,112.29 v36.21,112.2 | C2.2 35.21,121.05 v35.21,119.2 | C1.2 21.85,13.84 v21.21,13.2 | R7.1 11.21,114.39 v11.21,112.2 | v11.31,116.9 11.31,118.03 R5.1 | R2.1 v63.3,104.11 v63.31,104.1 | D3.C 30.52,79.61 v30.51,79.6 | C8.2 41.93,83.2 v40.21,83.2 | D2.A 28.56,91.55 v28.21,91.2 | C5.2 47.4,115.39 v47.21,115.2 | D8.A v64.31,120.7 | R11.1 v50.61,106.2
  pour Bottom (isolate 0.305, no thermals): -0.38,131.23 arc-90 1.91,133.52 68.07,133.52 arc-90 70.23,131.36 70.23,1.95 arc-90 67.95,-0.34 1.78,-0.34 arc-90 -0.38,1.82
  pour Top (no thermals): 41.61,91.3 41.61,89.3 39.71,89.3 39.31,88.9 39.31,86.1 34.61,86.1 34.61,82.1 33.31,82.1 33.31,81.2 25.61,81.2 25.61,83.2 25.71,83.3 32.61,83.3 33.81,84.5 33.91,84.5 33.91,86.1 34.41,86.6 38.51,86.6 38.81,86.9 38.81,91.3
I2C_SCL
  Top 0.25: U3.CN7_2 57.61,99.06 57.61,97.51 56.97,96.87 56.07,96.87 51.91,92.7 51.91,79.5 40.74,68.33 J3.1
I2C_SDA
  Top 0.25: U3.CN7_4 57.61,96.52 57.61,94.97 56.97,94.33 55.33,94.33 53.21,92.2 53.21,79.4 41.51,67.7 41.51,11.07 J3.2
N$1
  Top 0.25: R3.1 26.64,10.4 J1.1
N$2
  Top 0.3: D5.A 7.52,121.19 8.41,120.3 11.91,120.3 14,118.21 14,114.4 | 14,114.4 CR1.2 | F1.2 20.71,112.47 18.84,114.35 14.05,114.35 14,114.4
N$3
  Top 0.3: U2.VIN 34.2,122.84 C2.1 32.96,112.49 TVS_1.C 30.67,110.2 20.41,110.2 CR1.1
N$4
  Top 0.3: J2.P$2 27.55,116.04 F1.1
N$5
  pour Top (no thermals): 38.81,85.5 38.81,81.1 35.11,81.1 35.11,85.5
N$6
  pour Top (no thermals): 33.61,91.5 38.31,91.5 38.31,87.1 33.61,87.1
N$7
  Top 0.3: R5.2 4.92,118.77 D5.C
N$8
  pour Top (no thermals): 29.51,89.6 33.11,89.6 33.11,85 29.51,85
N$10
  Top 0.3: R7.2 4.31,114.74 D6.C
N$11
  Top 0.3: R12.1 R6.1 C5.1 R10.2
N$14
  Top 0.3: D7.C 65,110.73 R2.2
N$16
  pour Top (no thermals): 31.41,97 32.91,97 33.11,96.8 33.11,90.3 31.81,90.3 31.41,90.7
N$17  (via drill 0.35)
  Top 0.25: v64.21,115.2 64.21,117.12 D8.C
  Top 0.3: R9.2 59.11,115.25 59.16,115.2 v61.21,115.2
  Bottom 0.3: v64.21,115.2 v61.21,115.2
VOLT_DATA
  Top 0.25: C1.1 23.21,15.54 | 23.21,15.54 26.57,15.54 R3.2 | 23.21,15.54 23.97,16.3 R1.1 23.97,41.64 13.44,52.17 12.88,52.17 12.24,52.81 12.24,54.36 U3.CN9_11

### Text on the board
tPlace: M3 | CURR_SNSR / (-15V, +15V) | M3 | EXT_PWR / (+12V) | 12V PWR | -15V PWR | 5V PWR | +15V PWR | RoboRacing 2022 / EVGP Battery Monitor Board / Revision v1.1 | Board Number: | LCD (+5V) | M3 | M3 | VBATT